# EAGLE schematic ARboard (EAGLE 9.5.2)
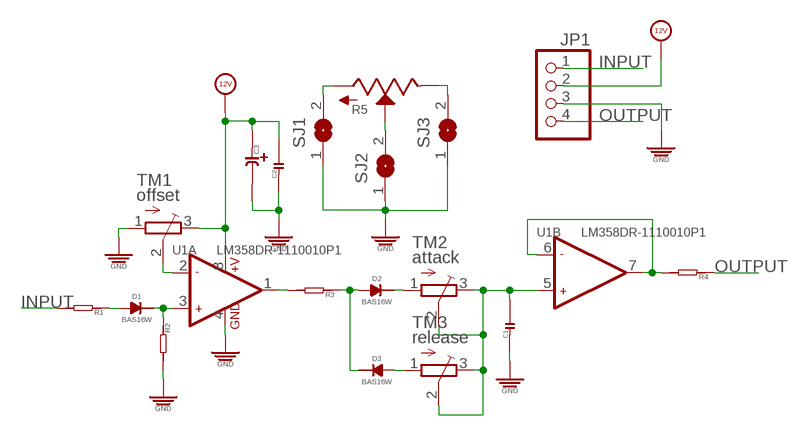
[diagram p0: schematic, sheet 1]

## Parts
C1  C-0603  [C0603]
C2  C-0603  [C0603]
C3  C-POLAR-A  [CASE-A_3216]
D1  BAS16W  [SOT-323]
D2  BAS16W  [SOT-323]
D3  BAS16W  [SOT-323]
JP1  PINHD-1X4  [1X04]
R1  R-0603  [R0603]
R2  R-0603  [R0603]
R3  R-0603  [R0603]
R4  R-0603  [R0603]
R5  POTSQUAREHOLE_SMALLKNOB  [ALPS_POT_SQUAREHOLES]
SJ1  SJ  [SJ]
SJ2  SJ  [SJ]
SJ3  SJ  [SJ]
TM1  offset  TRIMPOTTC33X  [TC33X]
TM2  attack  TRIMPOTTC33X  [TC33X]
TM3  release  TRIMPOTTC33X  [TC33X]
U1  LM358DR-1110010P1  [SOIC8]

## Nets
12V [power]: C2.2 C3.+ JP1.2 TM1.3(E) U1.8(A:+V)
GND [power]: C1.1 C2.1 C3.- JP1.3 R2.2 SJ1.1 SJ2.1 SJ3.1 TM1.1(A) U1.4(A:GND)
INPUT: JP1.1 R1.2
N$1: R5.P$3(A) SJ1.2
N$2: D2.ANODE D3.CATHODE R3.1
N$3: D3.ANODE TM3.1(A)
N$4: D2.CATHODE TM2.1(A)
N$5: R3.2 U1.1(A:OUT1)
N$6: TM1.2(S) U1.2(A:-IN1)
N$7: D1.CATHODE R2.1 U1.3(A:+IN1)
N$8: D1.ANODE R1.1
N$9: C1.2 TM2.2(S) TM2.3(E) TM3.2(S) TM3.3(E) U1.5(B:+IN2)
N$10: R4.2 U1.6(B:-IN2) U1.7(B:OUT2)
N$13: R5.P$2(S) SJ2.2
N$14: R5.P$1(E) SJ3.2
OUTPUT: JP1.4 R4.1

## Library data of the parts
C1 C2 = OPL:C*
C3 = EurorackModularParts:C-POLAR*
D1-D3 = FenixBase:BAS16W
JP1 = pinhead:PINHD-1X4: PIN HEADER
R1-R4 = OPL:R*
R5 = EurorackModularParts:POT
SJ1-SJ3 = jumper:SJ: SMD solder JUMPER
TM1-TM3 = adafruit:TRIMPOT: SMT trimmer potentiometer part number TC33X http://www.ladyada.net/library/eagle
U1 = OPL:LM358DR: General purpose LOW Voltage, Rail-to-Rail Output Amplifiers http://www.fairchildsemi.com/ds/LM/LMV358.pdf

## Net classes
0 default: width 0.254 mm
1 power: width 0.305 mm